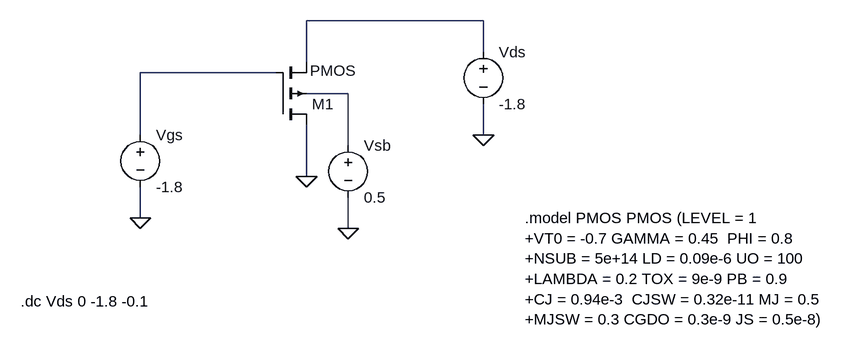
[diagram p0: schematic pmosdccharacteristics.asc]
pmosdccharacteristics.asc, the LTspice schematic file:
Version 4
SHEET 1 1004 680
WIRE 448 80 176 80
WIRE 448 128 448 80
WIRE 176 144 176 80
WIRE 128 160 -80 160
WIRE 240 192 176 192
WIRE -80 256 -80 160
WIRE 448 256 448 208
WIRE 240 272 240 192
WIRE 176 320 176 240
WIRE -80 384 -80 336
WIRE 240 400 240 352
FLAG 176 320 0
FLAG 448 256 0
FLAG 240 400 0
FLAG -80 384 0
SYMBOL pmos4 128 240 M180
WINDOW 3 53 83 Left 2
SYMATTR InstName M1
SYMBOL voltage 240 256 R0
SYMATTR InstName Vsb
SYMATTR Value 0.5
SYMBOL voltage -80 240 R0
SYMATTR InstName Vgs
SYMATTR Value -1.8
SYMBOL voltage 448 112 R0
SYMATTR InstName Vds
SYMATTR Value -1.8
TEXT 512 384 Left 2 !.model PMOS PMOS (LEVEL = 1\n+VT0 = -0.7 GAMMA = 0.45  PHI = 0.8\n+NSUB = 5e+14 LD = 0.09e-6 UO = 100\n+LAMBDA = 0.2 TOX = 9e-9 PB = 0.9\n+CJ = 0.94e-3  CJSW = 0.32e-11 MJ = 0.5\n+MJSW = 0.3 CGDO = 0.3e-9 JS = 0.5e-8)
TEXT -264 512 Left 2 !.dc Vds 0 -1.8 -0.1

The netlist it stands for:
* pmosdccharacteristics.asc
M1 0 N002 N001 N003 PMOS
Vsb N003 0 0.5
Vgs N002 0 -1.8
Vds N001 0 -1.8
.model NMOS NMOS
.model PMOS PMOS
.lib standard.mos
.model PMOS PMOS (LEVEL = 1
+VT0 = -0.7 GAMMA = 0.45  PHI = 0.8
+NSUB = 5e+14 LD = 0.09e-6 UO = 100
+LAMBDA = 0.2 TOX = 9e-9 PB = 0.9
+CJ = 0.94e-3  CJSW = 0.32e-11 MJ = 0.5
+MJSW = 0.3 CGDO = 0.3e-9 JS = 0.5e-8)
.dc Vds 0 -1.8 -0.1
.backanno
.end